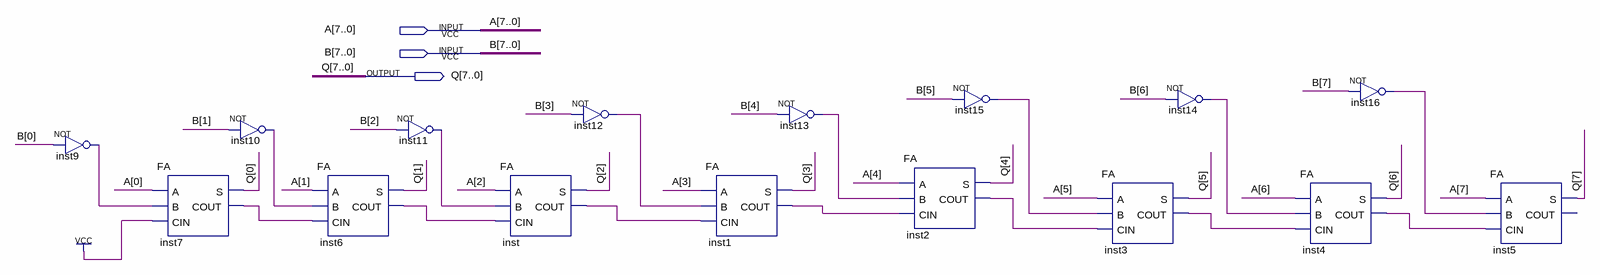
[diagram p0: schematic sheet]
// Quartus schematic SUB.bdf as structural Verilog: 16 symbols, 3 pins
module SUB (
  input  [7:0] A,
  input  [7:0] B,
  output [7:0] Q
);

  wire inst1_cout, inst2_cout, inst3_cout, inst4_cout, inst6_cout, inst7_cout, inst9_out, inst10_out,
       inst11_out, inst12_out, inst13_out, inst14_out, inst15_out, inst16_out, inst_cout;

  not inst9 (inst9_out, B[0]);
  FA inst7 (.A(A[0]), .B(inst9_out), .CIN(1'b1), .S(Q[0]), .COUT(inst7_cout));
  not inst10 (inst10_out, B[1]);
  FA inst6 (.A(A[1]), .B(inst10_out), .CIN(inst7_cout), .S(Q[1]), .COUT(inst6_cout));
  not inst11 (inst11_out, B[2]);
  FA inst (.A(A[2]), .B(inst11_out), .CIN(inst6_cout), .S(Q[2]), .COUT(inst_cout));
  not inst12 (inst12_out, B[3]);
  FA inst1 (.A(A[3]), .B(inst12_out), .CIN(inst_cout), .S(Q[3]), .COUT(inst1_cout));
  not inst13 (inst13_out, B[4]);
  FA inst2 (.A(A[4]), .B(inst13_out), .CIN(inst1_cout), .S(Q[4]), .COUT(inst2_cout));
  not inst15 (inst15_out, B[5]);
  FA inst3 (.A(A[5]), .B(inst15_out), .CIN(inst2_cout), .S(Q[5]), .COUT(inst3_cout));
  not inst14 (inst14_out, B[6]);
  FA inst4 (.A(A[6]), .B(inst14_out), .CIN(inst3_cout), .S(Q[6]), .COUT(inst4_cout));
  not inst16 (inst16_out, B[7]);
  FA inst5 (.A(A[7]), .B(inst16_out), .CIN(inst4_cout), .S(Q[7]));  // open: COUT
endmodule
